# Altium schematic sheet AC_DCConvertor_v2.SchDoc
size A4
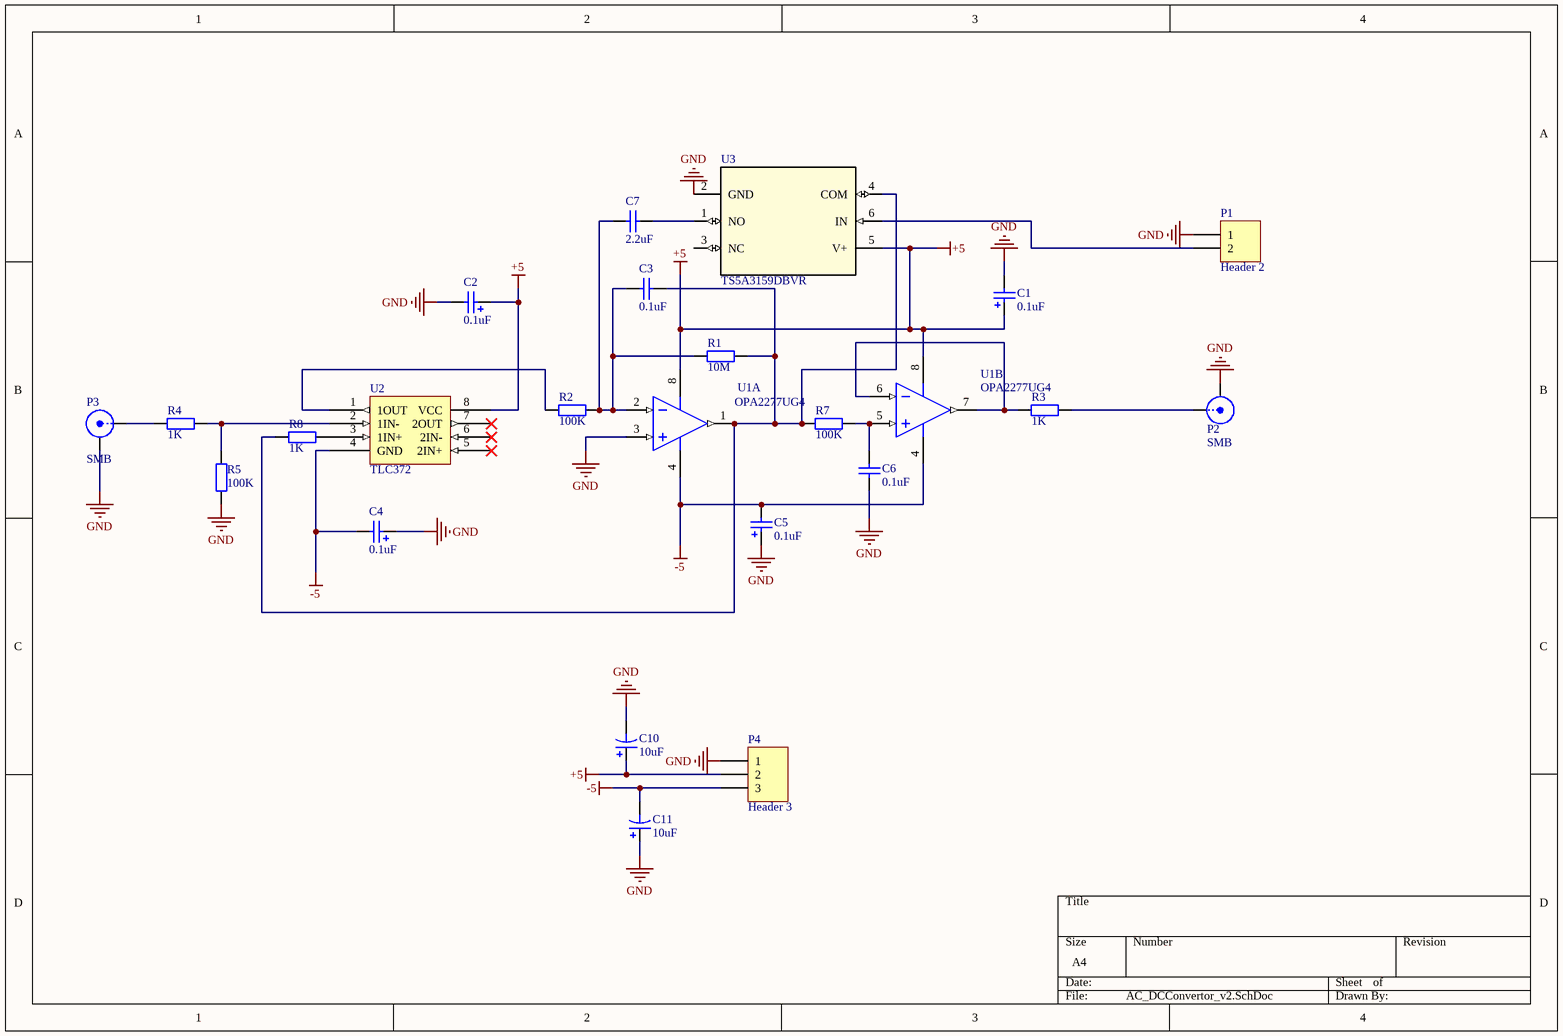
[diagram p0: AC_DCConvertor_v2.SchDoc]

## Parts
C1  value 0.1uF  [C0805]  (hidden comment: Cap Pol2)
C2  value 0.1uF  [C0805]  (hidden comment: Cap Pol2)
C3  value 0.1uF  [C0805]  (hidden comment: Cap Semi)
C4  value 0.1uF  [C0805]  (hidden comment: Cap Pol2)
C5  value 0.1uF  [C0805]  (hidden comment: Cap Pol2)
C6  value 0.1uF  [C0805]  (hidden comment: Cap Semi)
C7  value 2.2uF  [C0805]  (hidden comment: Cap Semi)
C10  value 10uF  [C0805]  (hidden comment: Cap Pol3)
C11  value 10uF  [C0805]  (hidden comment: Cap Pol3)
P1  Header 2  [HDR1X2]
P2  SMB  [SMB_V-RJ45]
P3  SMB  [SMB_V-RJ45]
P4  Header 3  [HDR1X3]
R1  value 10M  [C0805]  (hidden comment: Res2)
R2  value 100K  [C0805]  (hidden comment: Res2)
R3  value 1K  [C0805]  (hidden comment: Res2)
R4  value 1K  [C0805]  (hidden comment: Res2)
R5  value 100K  [C0805]  (hidden comment: Res2)
R7  value 100K  [C0805]  (hidden comment: Res2)
R8  value 1K  [C0805]  (hidden comment: Res2)
U1  OPA2277UG4  [TI-D8_M]  (parts A,B of 2)
U2  TLC372  [SO8_M]
U3  TS5A3159DBVR  [DBV0006A_N]

## Nets
+5: C1.1 C2.1 C10.1 P4.2 U1.8(V+) U2.8(VCC) U3.5(V+)
-5: C4.2 C5.2 C11.2 P4.3 U1.4(V-) U2.4(GND)
GND: C1.2 C2.2 C4.1 C5.1 C6.2 C10.2 C11.1 P1.1 P2.2(Y) P3.2(Y) P4.1 R5.1 U1.3(IN_A+) U3.2(GND)
NetC3_1: C3.1 C7.1 R1.1 R2.1 U1.2(IN_A-)
NetC3_2: C3.2 R1.2 R7.1 R8.1 U1.1(OUT_A) U3.4(COM)
NetC6_1: C6.1 R7.2 U1.5(IN_B+)
NetC7_2: C7.2 U3.1(NO)
NetP1_2: P1.2 U3.6(IN)
NetP2_1: P2.1(X) R3.2
NetP3_1: P3.1(X) R4.1
NetR2_2: R2.2 U2.1(1OUT)
NetR3_1: R3.1 U1.6(IN_B-) U1.7(OUT_B)
NetR4_2: R4.2 R5.2 U2.2(1IN-)
NetR8_2: R8.2 U2.3(1IN+)

Not connected (* = marked no-connect by the designer): U2 5(2IN+)* 6(2IN-)* 7(2OUT)*; U3 3(NC)

## Library data of the parts
C1 C2 C4 C5 = Cap Pol2: Polarized Capacitor (Axial); Published: 8-Jun-2000; LatestRevisionDate: 17-Jul-2002; LatestRevisionNote: Re-released for DXP Platform.; PackageReference: POLAR0.8; Publisher: Altium Limited; PackageDescription: Polarized Capacitor; 2 Leads
C3 C6 C7 = Cap Semi: Capacitor (Semiconductor SIM Model); Published: 8-Jun-2000; LatestRevisionDate: 29-May-2009; LatestRevisionNote: IPC-7351 Footprint Added.; PackageReference: C1206; Publisher: Altium Limited; PackageDescription: Chip Capacitor
C10 C11 = Cap Pol3: Polarized Capacitor (Surface Mount); Published: 8-Jun-2000; LatestRevisionDate: 29-May-2009; LatestRevisionNote: IPC-7351 Footprint Added.; PackageReference: C0805; Publisher: Altium Limited; PackageDescription: Chip Capacitor
P1 = Header 2: Header, 2-Pin; LatestRevisionDate: 17-Jul-2002; LatestRevisionNote: Re-released for DXP Platform.; Publisher: Altium Limited
P2 P3 = SMB: SMB Straight Connector; LatestRevisionDate: 17-Jul-2002; LatestRevisionNote: Re-released for DXP Platform.; Publisher: Altium Limited
P4 = Header 3: Header, 3-Pin; LatestRevisionDate: 17-Jul-2002; LatestRevisionNote: Re-released for DXP Platform.; Publisher: Altium Limited
R1-R5 R7 R8 = Res2: Resistor; Published: 8-Jun-2000; LatestRevisionDate: 17-Jul-2002; LatestRevisionNote: Re-released for DXP Platform.; PackageReference: AXIAL-0.4; Publisher: Altium Limited; PackageDescription: Axial Device, Thru-Hole; 2 Leads; 0.4 in Pin Spacing
U1 = OPA2277UG4: High Precision Operational Amplifier, 4 to 36 V, -40 to 85 degC, 8-pin SOIC (D8), Green (RoHS & no Sb/Br); Manufacturer: Texas Instruments; CMRR(Min)(dB): 130; GBW(Typ)(MHz): 1; IIB(Max)(pA): 1000; Iq per channel(Max)(mA): 0.825; Number of Channels: 2; Offset Drift(Typ)(uV/C): 0.1; Packing: TUBE; Rating: Catalog; Slew Rate(Typ)(V/us): 0.8; Sub Family: High Supply Voltage Amplifier (>=30V), Low Noise Amp (<=10nV/rtHz), Low Offset Voltage Amplifier (<=500uV), Precision Amplifier; Total Supply Voltage(Max)(+5V is 5, +/-5V is 10): 36; Total Supply Voltage(Min)(+5V is 5, +/-5V is 10): 4; Vio (25C)(Max)(mV): 0.025; DatasheetVersion: SBOS079A; PackageVersion: 4040047-3/M, 06/2011; PackageReference: D8; PackageDescription: 8-Pin Plastic Small Outline, Body 4.9 x 3.9 mm, Pitch 1.27 mm; Supplier 1: Digi-Key; Supplier Part Number 1: OPA2277UG4-ND; Supplier 2: Newark; Supplier Part Number 2: 80K2644; Supplier 3: Mouser; Supplier Part Number 3: 595-OPA2277UG4; Eco-Plan: Green (RoHS & no Sb/Br); Mounting Technology: Surface Mount; Code_JEDEC: MS-012; PartNumber: OPA2277UG4; ComponentLink1Description: Manufacturer URL; ComponentLink1URL: http://www.ti.com/; ComponentLink2Description: Datasheet; ComponentLink2URL: http://www.ti.com/lit/ds/symlink/opa2277.pdf; ComponentLink3Description: Package Specification; ComponentLink3URL: http://www.ti.com/litv/pdf/msoi002j
U3 = TS5A3159DBVR: Imported; Alternate PartNumber: TS5A3159DBVT; Manufacturer: Texas Instruments; CompType: IC; PIN_COUNT: 6; Application_BuildNumber: *; PartNumber: TS5A3159DBVR; PackageReference: DBV0006A; MountType: SMT; RoHS: Y; RefDes: RefDes; Type: DEV; Value: Value